# Altium schematic sheet LEDDrive1.SchDoc
size A3; SheetNumber: 2; SheetTotal: 3
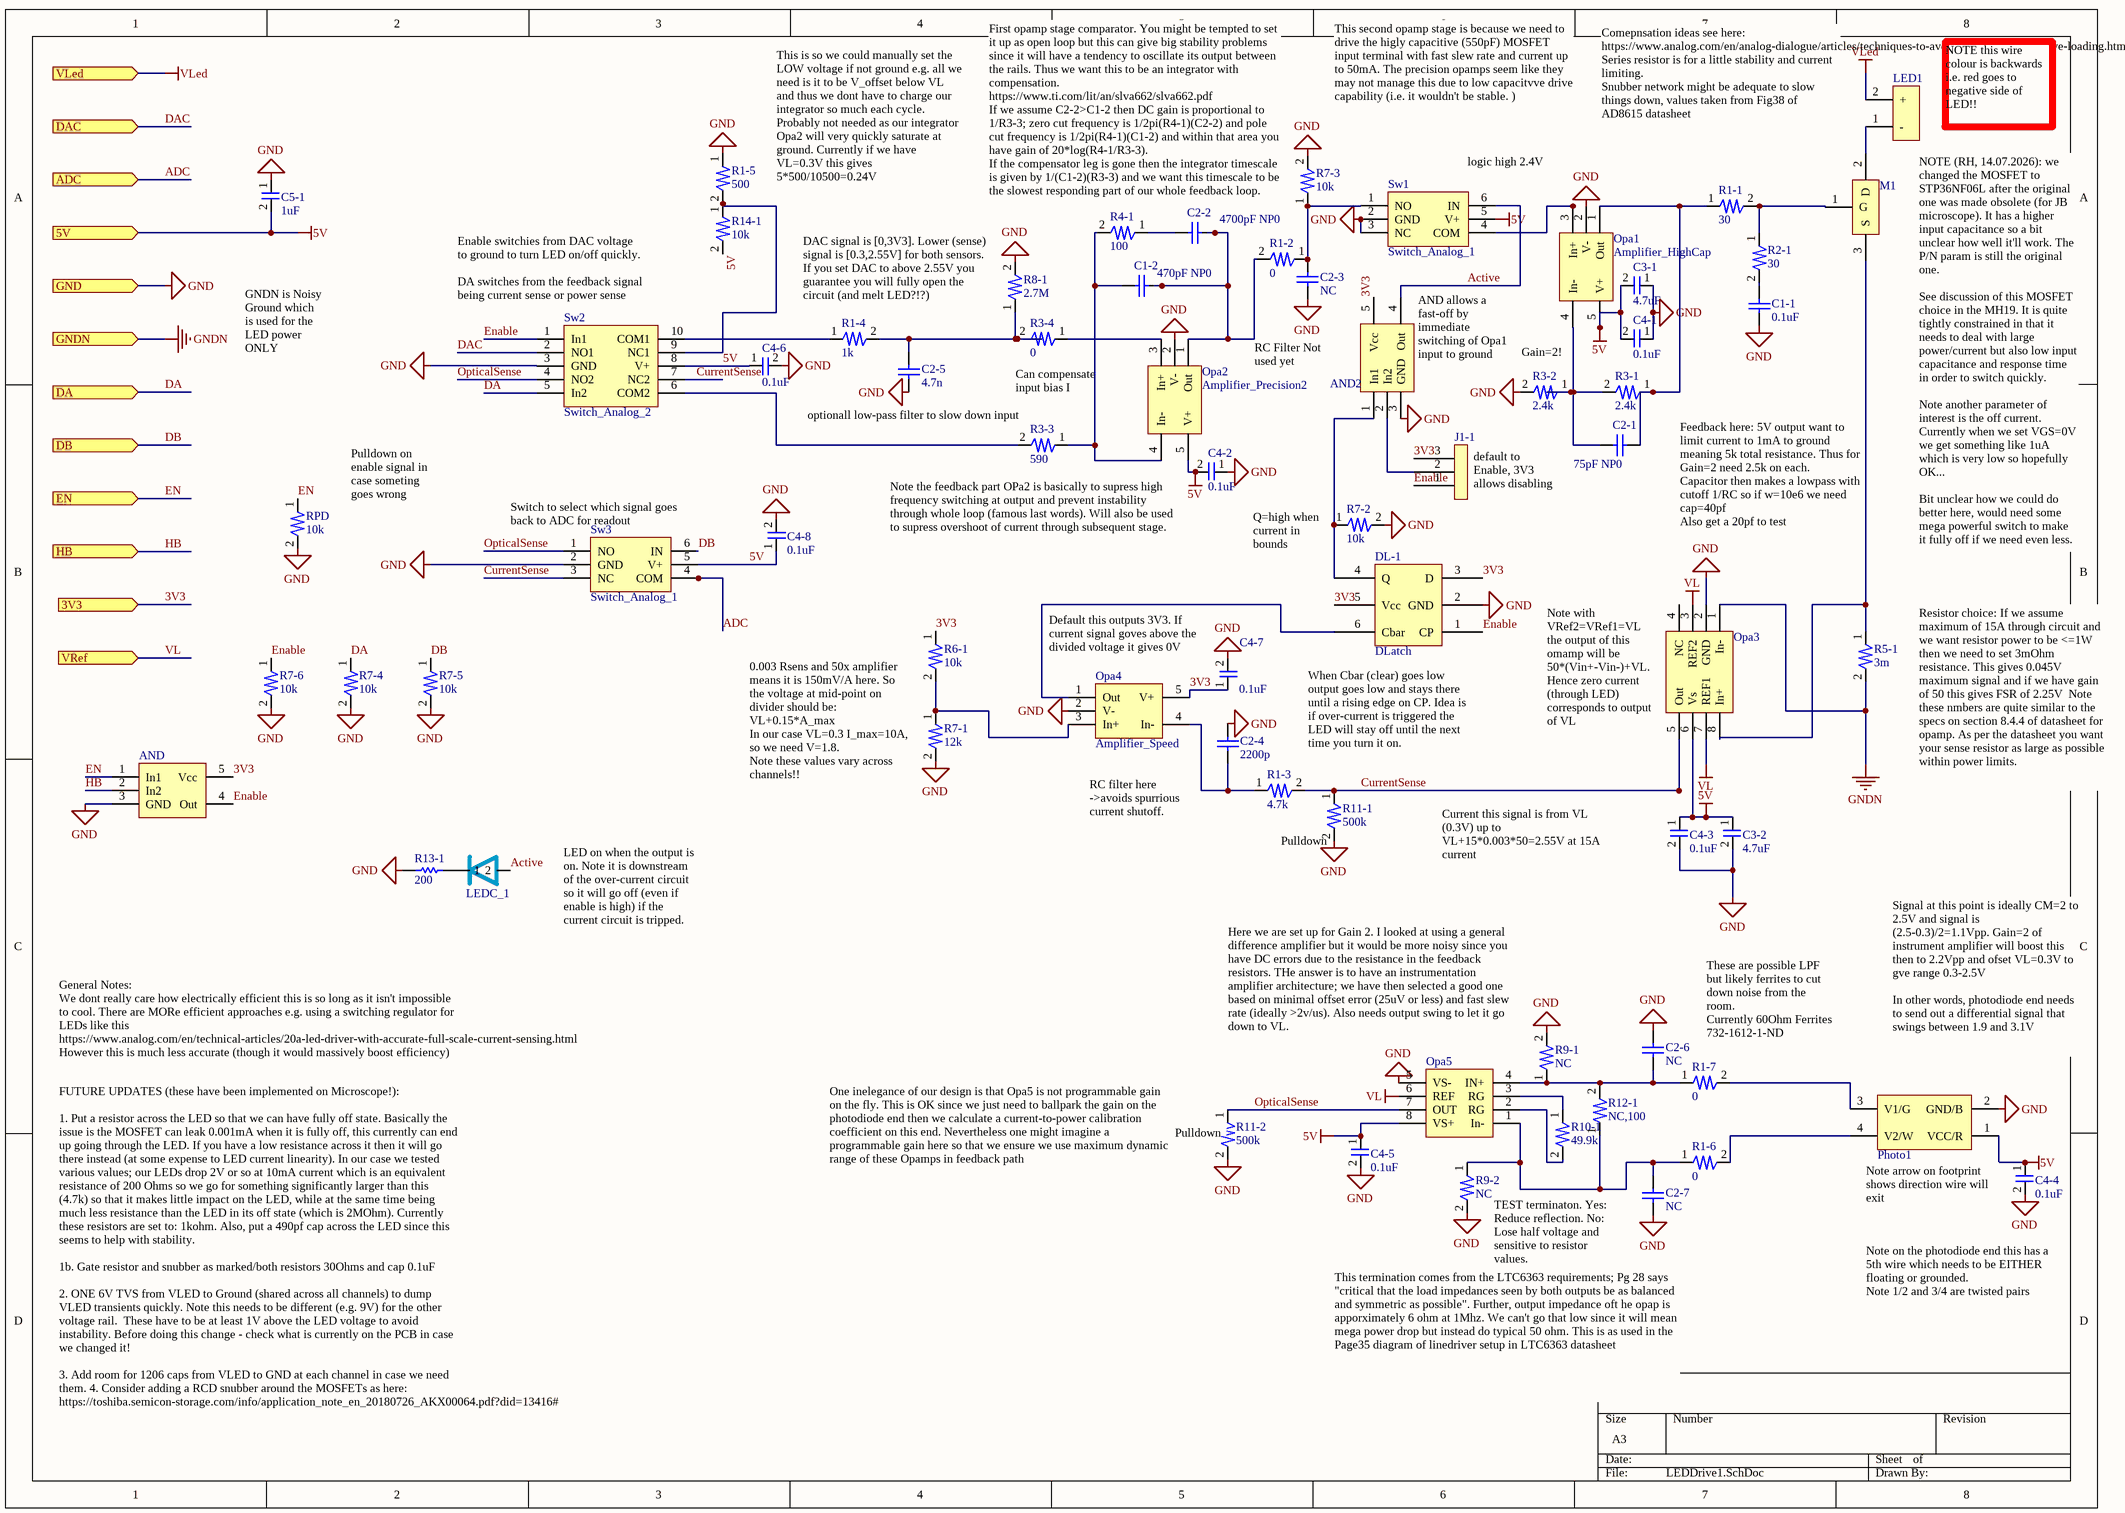
[diagram p0: LEDDrive1.SchDoc]

## Parts
AND  AND_Gate  [SOT23-5]  (value not drawn)
AND2  AND_Gate  [SOT23-5]  (value not drawn)
C1-1  0.1uF  [0805]
C1-2  470pF NP0  [0805]
C2-1  75pF NP0  [0805]
C2-2  4700pF NP0  [0805]
C2-3  NC  [0805]
C2-4  2200p  [0805]
C2-5  4.7n  [0805]
C2-6  NC  [0805]
C2-7  NC  [0805]
C3-1  4.7uF  [0805]
C3-2  4.7uF  [0805]
C4-1  0.1uF  [0805]
C4-2  0.1uF  [0805]
C4-3  0.1uF  [0805]
C4-4  0.1uF  [0805]
C4-5  0.1uF  [0805]
C4-6  0.1uF  [0805]
C4-7  0.1uF  [0805]
C4-8  0.1uF  [0805]
C5-1  1uF  [0805]
DL-1  DLatch  [6-TSSOP / SC-70-6]
J1-1  Jumper3B  [Jumper3B]  (value not drawn)
LED1  Header_Molex_Megafit  [Header Mini-Fit Jr 172648]  (value not drawn)
LEDC_1  LEDindicator  [LEDIndicator]  (value not drawn)
M1  MOSFET-N-POWER  [MOSFET_w_Heatsink]  (value not drawn)
Opa1  Amplifier_HighCap  [SOT23-5]
Opa2  Amplifier_Precision2  [SOT23-5]
Opa3  Amplifier_Current  [8-TSSOP]  (value not drawn)
Opa4  Amplifier_Speed  [SOT23-5]
Opa5  Amplifier_Instrumentation  [8-SOIC-NoHeatPad]  (value not drawn)
Photo1  Connector_M5  [Connector_M5]  (value not drawn)
R1-1  30  [0805]
R1-2  0  [0805]
R1-3  4.7k  [0805]
R1-4  1k  [0805]
R1-5  500  [0805]
R1-6  0  [0805]
R1-7  0  [0805]
R2-1  30  [0805]
R3-1  2.4k  [0805]
R3-2  2.4k  [0805]
R3-3  590  [0805]
R3-4  0  [0805]
R4-1  100  [0805]
R5-1  3m  [2512]
R6-1  10k  [0805]
R7-1  12k  [0805]
R7-2  10k  [0805]
R7-3  10k  [0805]
R7-4  10k  [0805]
R7-5  10k  [0805]
R7-6  10k  [0805]
R8-1  2.7M  [0805]
R9-1  NC  [0805]
R9-2  NC  [0805]
R10-1  49.9k  [0805]
R11-1  500k  [0805]
R11-2  500k  [0805]
R12-1  NC,100  [0805]
R13-1  200  [0603]
R14-1  10k  [0805]
RPD  10k  [0603]
Sw1  Switch_Analog_1  [SOT23-6]
Sw2  Switch_Analog_2  [10-VSSOP]
Sw3  Switch_Analog_1  [SOT23-6]

## Ports
3V3 (in), 5V (in), ADC (in), DA (in), DAC (in), DB (in), EN (in), GND (in), GNDN (in), HB (in), VLed (in), VRef (in)

## Nets
5V: C3-1.2 C3-2.1 C4-1.2 C4-2.2 C4-3.1 C4-4.1 C4-5.1 C4-6.1 C4-8.1 C5-1.2 Opa1.5(V+) Opa2.5(V+) Opa3.6(Vs) Opa5.8(VS+) Photo1.1(VCC/R) R14-1.2 Sw1.5(V+) Sw2.8(V+) Sw3.5(V+) ; port 5V
GND: AND.3(GND) AND2.3(GND) C1-1.1 C2-3.1 C2-4.1 C2-5.2 C2-6.2 C2-7.2 C3-1.1 C3-2.2 C4-1.1 C4-2.1 C4-3.2 C4-4.2 C4-5.2 C4-6.2 C4-7.2 C4-8.2 C5-1.1 DL-1.2(GND) Opa1.2(V-) Opa2.2(V-) Opa3.2(GND) Opa4.2(V-) Opa5.5(VS-) Photo1.2(GND/B) R1-5.1 R3-2.2 R7-1.2 R7-2.2 R7-3.2 R7-4.2 R7-5.2 R7-6.2 R8-1.2 R9-1.2 R9-2.2 R11-1.2 R11-2.2 R13-1.2 RPD.2 Sw1.2(GND) Sw1.3(NC) Sw2.3(GND) Sw3.2(GND) ; port GND
GNDN: Opa3.1(In-) R5-1.2 ; port GNDN
VL: Opa3.3(REF2) Opa3.7(REF1) Opa5.6(REF) ; port VRef
VLed: LED1.2(+) ; port VLed
3V3: AND.5(Vcc) AND2.5(Vcc) C4-7.1 DL-1.3(D) DL-1.5(Vcc) J1-1.3 Opa4.5(V+) R6-1.1 ; port 3V3
Active: AND2.4(Out) LEDC_1.2 Sw1.6(IN)
ADC: Sw3.4(COM) ; port ADC
CurrentSense: Opa3.5(Out) R1-3.2 R11-1.1 Sw2.7(NC2) Sw3.3(NC)
DA: R7-4.1 Sw2.5(In2) ; port DA
DAC: Sw2.2(NO1) ; port DAC
DB: R7-5.1 Sw3.6(IN) ; port DB
EN: AND.1(In1) RPD.1 ; port EN
Enable: AND.4(Out) DL-1.1(CP) J1-1.1 R7-6.1 Sw2.1(In1)
HB: AND.2(In2) ; port HB
OpticalSense: Opa5.7(OUT) R11-2.1 Sw2.4(NO2) Sw3.1(NO)
NetAND2_1: AND2.1(In1) DL-1.4(Q) R7-2.1
NetAND2_2: AND2.2(In2) J1-1.2
NetC1-1_2: C1-1.2 R2-1.2
NetC1-2_1: C1-2.1 C2-2.1 Opa2.1(Out) R1-2.2
NetC1-2_2: C1-2.2 Opa2.4(In-) R3-3.1 R4-1.2
NetC2-1_1: C2-1.1 Opa1.1(Out) R1-1.1 R3-1.1
NetC2-1_2: C2-1.2 Opa1.4(In-) R3-1.2 R3-2.1
NetC2-2_2: C2-2.2 R4-1.1
NetC2-3_2: C2-3.2 R1-2.1 R7-3.1 Sw1.1(NO)
NetC2-4_2: C2-4.2 Opa4.4(In-) R1-3.1
NetC2-5_1: C2-5.1 R1-4.2 R3-4.2 R8-1.1
NetC2-6_1: C2-6.1 Opa5.4(IN+) R1-7.1 R9-1.1 R12-1.2
NetC2-7_1: C2-7.1 Opa5.1(In-) R1-6.1 R9-2.1 R12-1.1
NetDL-1_6: DL-1.6(Cbar) Opa4.1(Out)
NetLED1_1: LED1.1(-) M1.2(D)
NetLEDC_1_1: LEDC_1.1 R13-1.1
NetM1_1: M1.1(G) R1-1.2 R2-1.1
NetM1_3: M1.3(S) Opa3.8(In+) R5-1.1
NetOpa1_3: Opa1.3(In+) Sw1.4(COM)
NetOpa2_3: Opa2.3(In+) R3-4.1
NetOpa4_3: Opa4.3(In+) R6-1.2 R7-1.1
NetOpa5_2: Opa5.2(RG) R10-1.2
NetOpa5_3: Opa5.3(RG) R10-1.1
NetPhoto1_3: Photo1.3(V1/G) R1-7.2
NetPhoto1_4: Photo1.4(V2/W) R1-6.2
NetR1-4_1: R1-4.1 Sw2.10(COM1)
NetR1-5_2: R1-5.2 R14-1.1 Sw2.9(NC1)
NetR3-3_2: R3-3.2 Sw2.6(COM2)

Not connected (* = marked no-connect by the designer): Opa3 4(NC)

## Notes on the sheet
- This second opamp stage is because we need to drive the higly capacitive (550pF) MOSFET input terminal with fast slew rate and current up to 50mA. The precision opamps seem like they may not manage this due to low capacitvve drive capability (i.e. it wouldn't be stable. )
- (near Sw1) logic high 2.4V
- (near M1) Comepnsation ideas see here: https://www.analog.com/en/analog-dialogue/articles/techniques-to-avoid-instability-capacitive-loading.html
  Series resistor is for a little stability and current limiting.
  Snubber network might be adequate to slow things down, values taken from Fig38 of AD8615 datasheet
- (near LED1) NOTE this wire colour is backwards i.e. red goes to negative side of LED!!
- This is so we could manually set the LOW voltage if not ground e.g. all we need is it to be V_offset below VL and thus we dont have to charge our integrator so much each cycle. Probably not needed as our integrator Opa2 will very quickly saturate at ground. Currently if we have VL=0.3V this gives 5*500/10500=0.24V
- First opamp stage comparator. You might be tempted to set it up as open loop but this can give big stability problems since it will have a tendency to oscillate its output between the rails. Thus we want this to be an integrator with compensation.
  https://www.ti.com/lit/an/slva662/slva662.pdf
  If we assume C2-2>C1-2 then DC gain is proportional to 1/R3-3; zero cut frequency is 1/2pi(R4-1)(C2-2) and pole cut frequency is 1/2pi(R4-1)(C1-2) and within that area you have gain of 20*log(R4-1/R3-3).
  If the compensator leg is gone then the integrator timescale is given by 1/(C1-2)(R3-3) and we want this timescale to be the slowest responding part of our whole feedback loop.
- (near Sw2) Enable switchies from DAC voltage to ground to turn LED on/off quickly.
  DA switches from the feedback signal being current sense or power sense
- DAC signal is [0,3V3]. Lower (sense) signal is [0.3,2.55V] for both sensors.
  If you set DAC to above 2.55V you guarantee you will fully open the circuit (and melt LED?!?)
- GNDN is Noisy Ground which is used for the LED power ONLY
- (near R3-4) Can compensate input bias I
- RC Filter Not used yet
- (near AND2) AND allows a fast-off by immediate switching of Opa1 input to ground
- (near R3-2) Gain=2!
- (near R3-3) optionall low-pass filter to slow down input
- (near RPD) Pulldown on enable signal in case someting goes wrong
- (near Sw3) Switch to select which signal goes back to ADC for readout
- (near J1-1) default to Enable, 3V3 allows disabling
- Feedback here: 5V output want to limit current to 1mA to ground meaning 5k total resistance. Thus for Gain=2 need 2.5k on each.
  Capacitor then makes a lowpass with cutoff 1/RC so if w=10e6 we need cap=40pf
  Also get a 20pf to test
- Note the feedback part OPa2 is basically to supress high frequency switching at output and prevent instability through whole loop (famous last words). Will also be used to supress overshoot of current through subsequent stage.
- (near R7-2) Q=high when current in bounds
- NOTE (RH, 14.07.2026): we changed the MOSFET to STP36NF06L after the original one was made obsolete (for JB microscope). It has a higher input capacitance so a bit unclear how well it'll work. The P/N param is still the original one.
  See discussion of this MOSFET choice in the MH19. It is quite tightly constrained in that it needs to deal with large power/current but also low input capacitance and response time in order to switch quickly.
  Note another parameter of interest is the off current. Currently when we set VGS=0V we get something like 1uA which is very low so hopefully OK...
  Bit unclear how we could do better here, would need some mega powerful switch to make it fully off if we need even less.
- (near C4-7) Default this outputs 3V3. If current signal goves above the divided voltage it gives 0V output.
- 0.003 Rsens and 50x amplifier means it is 150mV/A here. So the voltage at mid-point on divider should be:
  VL+0.15*A_max
  In our case VL=0.3 I_max=10A, so we need V=1.8.
  Note these values vary across channels!!
- When Cbar (clear) goes low output goes low and stays there until a rising edge on CP. Idea is if over-current is triggered the LED will stay off until the next time you turn it on.
- (near Opa3) Note with VRef2=VRef1=VL the output of this omamp will be 50*(Vin+-Vin-)+VL.
  Hence zero current (through LED) corresponds to output of VL
- (near R5-1) Resistor choice: If we assume maximum of 15A through circuit and we want resistor power to be <=1W then we need to set 3mOhm resistance. This gives 0.045V maximum signal and if we have gain of 50 this gives FSR of 2.25V  Note these nmbers are quite similar to the specs on section 8.4.4 of datasheet for opamp. As per the datasheet you want your sense resistor as large as possible within power limits.
- RC filter here ->avoids spurrious current shutoff. Current time-constant is 1.5us or so.
- (near R11-1) Pulldown
- Current this signal is from VL (0.3V) up to VL+15*0.003*50=2.55V at 15A current
- LED on when the output is on. Note it is downstream of the over-current circuit so it will go off (even if enable is high) if the current circuit is tripped.
- Here we are set up for Gain 2. I looked at using a general difference amplifier but it would be more noisy since you have DC errors due to the resistance in the feedback resistors. THe answer is to have an instrumentation amplifier architecture; we have then selected a good one based on minimal offset error (25uV or less) and fast slew rate (ideally >2v/us). Also needs output swing to let it go down to VL.
- (near R1-7) These are possible LPF but likely ferrites to cut down noise from the room.
  Currently 60Ohm Ferrites 732-1612-1-ND
- (near Photo1) Signal at this point is ideally CM=2 to 2.5V and signal is (2.5-0.3)/2=1.1Vpp. Gain=2 of instrument amplifier will boost this then to 2.2Vpp and ofset VL=0.3V to gve range 0.3-2.5V
  In other words, photodiode end needs to send out a differential signal that swings between 1.9 and 3.1V
- General Notes:
  We dont really care how electrically efficient this is so long as it isn't impossible to cool. There are MORe efficient approaches e.g. using a switching regulator for LEDs like this https://www.analog.com/en/technical-articles/20a-led-driver-with-accurate-full-scale-current-sensing.html
  However this is much less accurate (though it would massively boost efficiency)
- (near R11-2) Pulldown
- (near R11-2) One inelegance of our design is that Opa5 is not programmable gain on the fly. This is OK since we just need to ballpark the gain on the photodiode end then we calculate a current-to-power calibration coefficient on this end. Nevertheless one might imagine a programmable gain here so that we ensure we use maximum dynamic range of these Opamps in feedback path
- TEST terminaton. Yes: Reduce reflection. No: Lose half voltage and sensitive to resistor values.
- Note arrow on footprint shows direction wire will exit
- Note on the photodiode end this has a 5th wire which needs to be EITHER floating or grounded.
  Note 1/2 and 3/4 are twisted pairs
- This termination comes from the LTC6363 requirements; Pg 28 says "critical that the load impedances seen by both outputs be as balanced and symmetric as possible". Further, output impedance oft he opap is apporximately 6 ohm at 1Mhz. We can't go that low since it will mean mega power drop but instead do typical 50 ohm. This is as used in the Page35 diagram of linedriver setup in LTC6363 datasheet
- FUTURE UPDATES (these have been implemented on Microscope!):
  1. Put a resistor across the LED so that we can have fully off state. Basically the issue is the MOSFET can leak 0.001mA when it is fully off, this currently can end up going through the LED. If you have a low resistance across it then it will go there instead (at some expense to LED current linearity). In our case we tested various values; our LEDs drop 2V or so at 10mA current which is an equivalent resistance of 200 Ohms so we go for something significantly larger than this (4.7k) so that it makes little impact on the LED, while at the same time being much less resistance than the LED in its off state (which is 2MOhm). Currently these resistors are set to: 1kohm. Also, put a 490pf cap across the LED since this seems to help with stability.
  1b. Gate resistor and snubber as marked/both resistors 30Ohms and cap 0.1uF
  2. ONE 6V TVS from VLED to Ground (shared across all channels) to dump VLED transients quickly. Note this needs to be different (e.g. 9V) for the other voltage rail.  These have to be at least 1V above the LED voltage to avoid instability. Before doing this change - check what is currently on the PCB in case we changed it!
  3. Add room for 1206 caps from VLED to GND at each channel in case we need them. 4. Consider adding a RCD snubber around the MOSFETs as here: https://toshiba.semicon-storage.com/info/application_note_en_20180726_AKX00064.pdf?did=13416#

## Library data of the parts
C1-1 C1-2 C2-1-C2-7 = Cap 0805: Capacitor
  C1-1: Digikey P/N: 311-4178-1-ND
  C1-2: Digikey P/N: 399-15465-1-ND
  C2-1-C2-7: Digikey P/N: 478-13047-1-ND, 13-CC0805GRNPO9BN390CT-ND
C3-1 C3-2 C4-1-C4-8 C5-1 = Capacitor1
  C5-1: Digikey P/N: 1276-1066-1-ND
DL-1 = DLatch: D-Latch; FP: 6-TSSOP; Digikey P/N: 296-16998-1-ND
R1-1-R1-7 R2-1 R3-1-R3-4 R4-1 R5-1 R6-1 R7-1-R7-6 R8-1 R9-1 R9-2 R10-1 R11-1 R11-2 R12-1 R14-1 RPD = Res1
  R1-1-R1-3: Digikey P/N: 511-SDR10EZPF10R0CT-ND
  R1-4: Digikey P/N: YAG3755CT-ND
  R1-6: Digikey P/N: 732-1612-1-ND
  R1-7: Digikey P/N: 732-1612-1-ND, 490-BLM21HE601SN1LCT-ND
  R2-1: Digikey P/N: P165DACT-ND
  R3-1-R3-4: Digikey P/N: P2.4KBFCT-ND
  R4-1: Digikey P/N: 408-RG2012N-4990-B-T5CT-ND
  R5-1: Digikey P/N: 4506-SEWF2512F3L00P9CT-ND
  R6-1: Digikey P/N: 738-RMCF0805JT12K0CT-ND
  R7-1-R7-6 R11-2: Digikey P/N: Any
  R8-1: Digikey P/N: 408-2028-1-ND
  R10-1: Digikey P/N: TNPU49.9KBBCT-ND
  R11-1: Digikey P/N: 118-CR0805-FX-4993ELFCT-ND
  R12-1: Digikey P/N: A140898CT-ND
R13-1 = Res1: Resistor; Footprint: 0603 (1608 Metric)
AND AND2 = AND_Gate: Digikey P/N: 296-11601-1-ND
J1-1 = Jumper3B: Digikey P/M: 609-3461-ND, S9000-ND
LED1 = Header_Molex_Megafit: Digikey P/N: 1726480102-ND, 900-2171590220-ND
LEDC_1 = LEDindicator: Digikey: https://www.digikey.co.uk/product-detail/en/osram-opto-semiconductors-inc/LG-R971-KN-1/475-1410-1-ND/1802598; Digikey P/N: 475-1410-1-ND
M1 = MOSFET-N-POWER: Digikey P/N: 1727-5893-ND, PA-T21-38E-ND, C220-050-2AE-ND, 926-1009-ND
Opa1 = Amplifier_HighCap: Digikey P/N: 296-LM7321MFE/NOPBCT-ND
Opa2 = Amplifier_Precision2: Digikey P/N: 296-OPA388QDBVRQ1CT-ND
Opa3 = Amplifier_Current: Digikey P/N: 296-INA296A3IDGKRCT-ND
Opa4 = Amplifier_Speed: Digikey P/N: 296-32191-1-ND
Opa5 = Amplifier_Instrumentation: Digikey P/N: 296-INA821IDRCT-ND
Photo1 = Connector_M5: Digikey P/N: 839-1564-ND, 839-10-03879-ND
Sw1 Sw3 = Switch_Analog_1: Digikey P/N: 296-21189-1-ND
Sw2 = Switch_Analog_2: Digikey P/N: 296-32591-1-ND